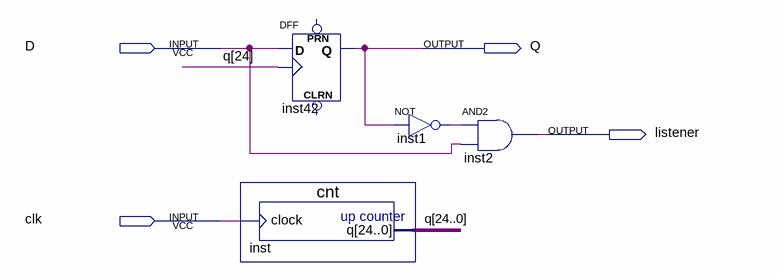
[diagram p0: schematic sheet]
// Quartus schematic t8.bdf as structural Verilog: 4 symbols, 4 pins
module t8 (
  input  D,
  input  clk,
  output Q,
  output listener
);

  wire inst1_out;
  wire [24:0] Q_bus;

  cnt inst (.clock(clk), .q(Q_bus));
  DFF inst42 (.CLK(Q_bus[24]), .D(D), .Q(Q));  // open: CLRN, PRN
  not inst1 (inst1_out, Q);
  and inst2 (listener, inst1_out, D);
endmodule
